# EAGLE design UKHASnet-avr-sensor (EAGLE 6.5.0)
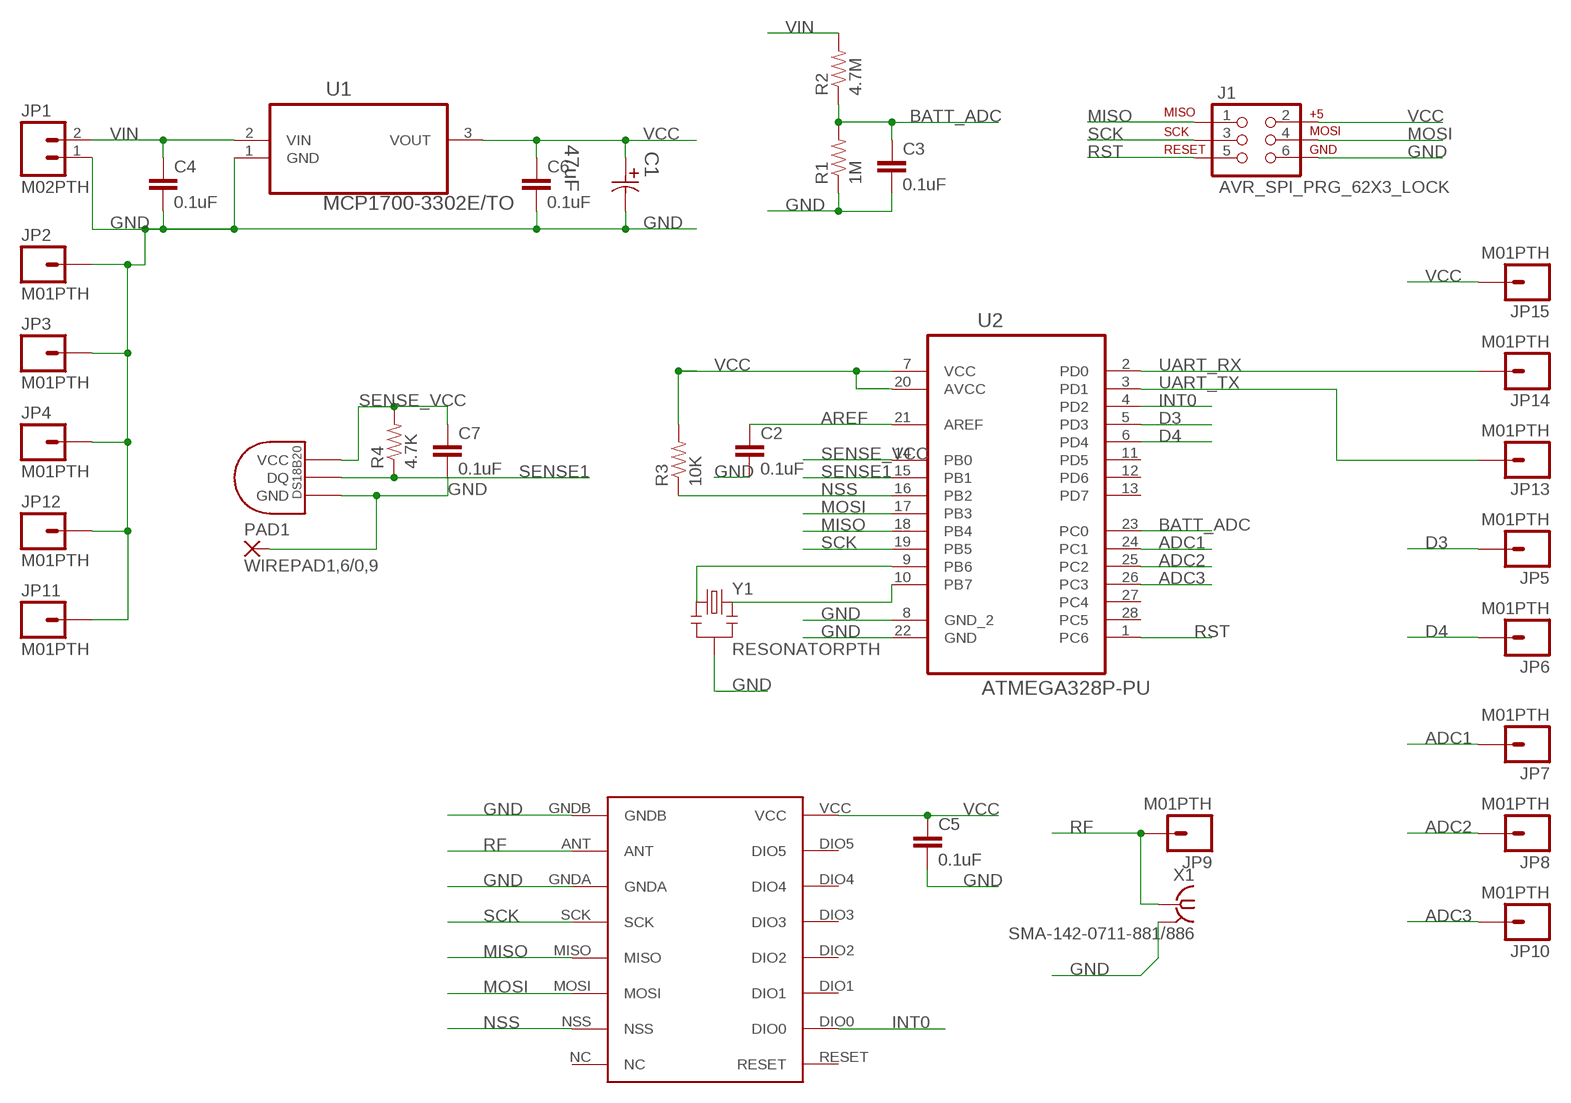
[diagram p0: schematic, sheet 1]

## Parts
C1  47uF  EEUFC1J6R8-P1.5  [CAPPR150-400X1200]
C2  0.1uF  C2.5/2  [C2.5-2]
C3  0.1uF  C2.5/2  [C2.5-2]
C4  0.1uF  C2.5/2  [C2.5-2]
C5  0.1uF  C2.5/2  [C2.5-2]
C6  0.1uF  C2.5/2  [C2.5-2]
C7  0.1uF  C2.5/2  [C2.5-2]
J1  AVR_SPI_PRG_62X3_LOCK  [2X3_LOCK]
JP1  M02PTH  [1X02]
JP2  M01PTH  [1X01]
JP3  M01PTH  [1X01]
JP4  M01PTH  [1X01]
JP5  M01PTH  [1X01]
JP6  M01PTH  [1X01]
JP7  M01PTH  [1X01]
JP8  M01PTH  [1X01]
JP9  M01PTH  [1X01]
JP10  M01PTH  [1X01]
JP11  M01PTH  [1X01]
JP12  M01PTH  [1X01]
JP13  M01PTH  [1X01]
JP14  M01PTH  [1X01]
JP15  M01PTH  [1X01]
PAD1  WIREPAD1,6/0,9  [1,6/0,9]
R1  1M  RESISTORPTH-1/4W  [AXIAL-0.4]
R2  4.7M  RESISTORPTH-1/4W  [AXIAL-0.4]
R3  10K  RESISTORPTH-1/4W  [AXIAL-0.4]
R4  4.7K  RESISTORPTH-1/4W  [AXIAL-0.4]
U1  MCP1700-3302E/TO  [TO127P254X495-3]
U2  ATMEGA328P-PU  [DIP254P762X457-28]
U$1  RFM69HW  [RFM]
U$2  DS1820TO92  [DS1820]
X1  SMA-142-0711-881/886  [J502-ND-142-0711-881/886]
Y1  RESONATORPTH  [RESONATOR-PTH]

## Nets
ADC1: JP7.1 U2.24(PC1)
ADC2: JP8.1 U2.25(PC2)
ADC3: JP10.1 U2.26(PC3)
AREF: C2.1 U2.21(AREF)
BATT_ADC: C3.1 R1.P$2 R2.P$1 U2.23(PC0)
D3: JP5.1 U2.5(PD3)
D4: JP6.1 U2.6(PD4)
GND: C1.2 C2.2 C3.2 C4.2 C5.2 C6.2 C7.2 J1.6 JP1.1 JP2.1 JP3.1 JP4.1 JP11.1 JP12.1 PAD1.1(P) R1.P$1 U1.1(GND) U2.8(GND_2) U2.22(GND) U$1.GNDA U$1.GNDB U$2.GND X1.G@1 X1.G@2 X1.G@3 X1.G@4 Y1.2
INT0: U2.4(PD2) U$1.DIO0
MISO: J1.1 U2.18(PB4) U$1.MISO
MOSI: J1.4 U2.17(PB3) U$1.MOSI
N$10: U2.10(PB7) Y1.3
N$11: U2.9(PB6) Y1.1
NSS: R3.P$1 U2.16(PB2) U$1.NSS
RF [RF]: JP9.1 U$1.ANT X1.1
RST: J1.5 U2.1(PC6)
SCK: J1.3 U2.19(PB5) U$1.SCK
SENSE1: R4.P$1 U2.15(PB1) U$2.DQ
SENSE_VCC: C7.1 R4.P$2 U2.14(PB0) U$2.VDD(VCC)
UART_RX: JP14.1 U2.2(PD0)
UART_TX: JP13.1 U2.3(PD1)
VCC: C1.1 C5.1 C6.1 J1.2 JP15.1 R3.P$2 U1.3(VOUT) U2.7(VCC) U2.20(AVCC) U$1.VCC
VIN: C4.1 JP1.2 R2.P$2 U1.2(VIN)
Unconnected: U2.11(PD5) U2.12(PD6) U2.13(PD7) U2.27(PC4) U2.28(PC5) U$1.DIO1 U$1.DIO2 U$1.DIO3 U$1.DIO4 U$1.DIO5 U$1.NC U$1.RESET

## Library data of the parts
C1 = 1000ufCap:EEU: Aluminum Electrolytic Capacitors; MPN: EEUFC1J6R8; OC_FARNELL: 1848468; OC_NEWARK: 17T5110; RATEDVOLTAGE: 63V; SUPPLIER: PANASONIC; TOLERANCE: ±20 %; VALUE: 6.8UF
C2-C7 = capacitor-wima:C: CAPACITOR naming: grid - package width
J1 = SparkFun-Connectors:AVR_SPI_PRG_6: AVR ISP 6 Pin This is the reduced ISP connector for AVR programming. Common on Arduino. This footprint will take up less PCB space and can be used with a 10-pin to 6-pin adapter such as SKU: BOB-08508
JP1 = SparkFun-Connectors:M02: Standard 2-pin 0.1" header. Use with - straight break away headers ( PRT-00116) - right angle break away headers (PRT-00553) - swiss pins (PRT-00743) - machine pins (PRT-00117) - female headers (PRT-00115) Molex polarized connector foot print use with: PRT-08233 with associated crimp pins and housings. 2.54_SCREWTERM for use with PRT-10571. 3.5mm Screw Terminal footprints for PRT-08084 5mm Screw Terminal footprints for use with PRT-08433
JP2-JP15 = SparkFun-Connectors:M01: Header 1 Standard 1-pin 0.1" header. Use with straight break away headers (SKU : PRT-00116), right angle break away headers (PRT-00553), swiss pins (PRT-00743), machine pins (PRT-00117), and female headers (PRT-00115).
PAD1 = wirepad:WIREPAD: Wire PAD connect wire on PCB
R1-R4 = SparkFun:RESISTOR: Resistor Basic schematic elements and footprints for 0603, 1206, and PTH resistors.
U1 = mcp1700:MCP1700-3302E/TO: IC, Low Quiescent Current LDO,3.3V,TO-92; MPN: MCP1700-3302E/TO; OC_FARNELL: 1296588; OC_NEWARK: 88H9804; PACKAGE: TO-92; SUPPLIER: Microchip
U2 = atmega328-dil:ATMEGA328P-PU: 8-bit Microcontroller with In-System Programmable Flash; MPN: ATMEGA328P-PU; OC_FARNELL: 1715487; OC_NEWARK: 15R0268; PACKAGE: PDIP-28; SUPPLIER: Atmel
U$1 = hopeRF2:RFM69HW
U$2 = Ava:DS1820: DS18B20 Programmable Resolution 1-Wire Digital Thermometer Description The DS18B20 digital thermometer provides 9-bit to 12-bit Celsius temperature measurements and has an alarm function with nonvolatile user-programmable upper and lower trigger points. The DS18B20 communicates over a 1-Wire® bus that by definition requires only one data line (and ground) for communication with a central microprocessor. It has an operating temperature range of -55°C to +125°C and is accurate to ±0.5°C over the range of -10°C to +85°C. In addition, the DS18B20 can derive power directly from the data line ("parasite power"), eliminating the need for an external power supply. Each DS18B20 has a unique 64-bit serial code, which allows multiple DS18B20s to function on the same 1-Wire bus. Thus, it is simple to use one microprocessor to control many DS18B20s distributed over a large area. Applications that can benefit from this feature include HVAC environmental controls, temperature monitoring systems inside buildings, equipment, or machinery, and process monitoring and control systems.
X1 = con-coax:SMA-: SMA 50 Ohm End Launch Jack Receptacle - Round Contact Johnson Components Source: www.johnsoncomponents.com .. J502-ND.pdf; MF: JOHNSON COMPONENTS; MPN: 142-0711-881; OC_FARNELL: unknown; OC_NEWARK: 50B4464
Y1 = SparkFun:RESONATOR: Resonator Small SMD resonator. This is the itty bitty 10/20MHz resonators with built in caps. CSTCE10M0G55 and CSTCE20M0V53. Footprint has been reviewed closely but hasn't been tested yet.

## Net classes
1 RF: clearance 0.381 mm

## Board
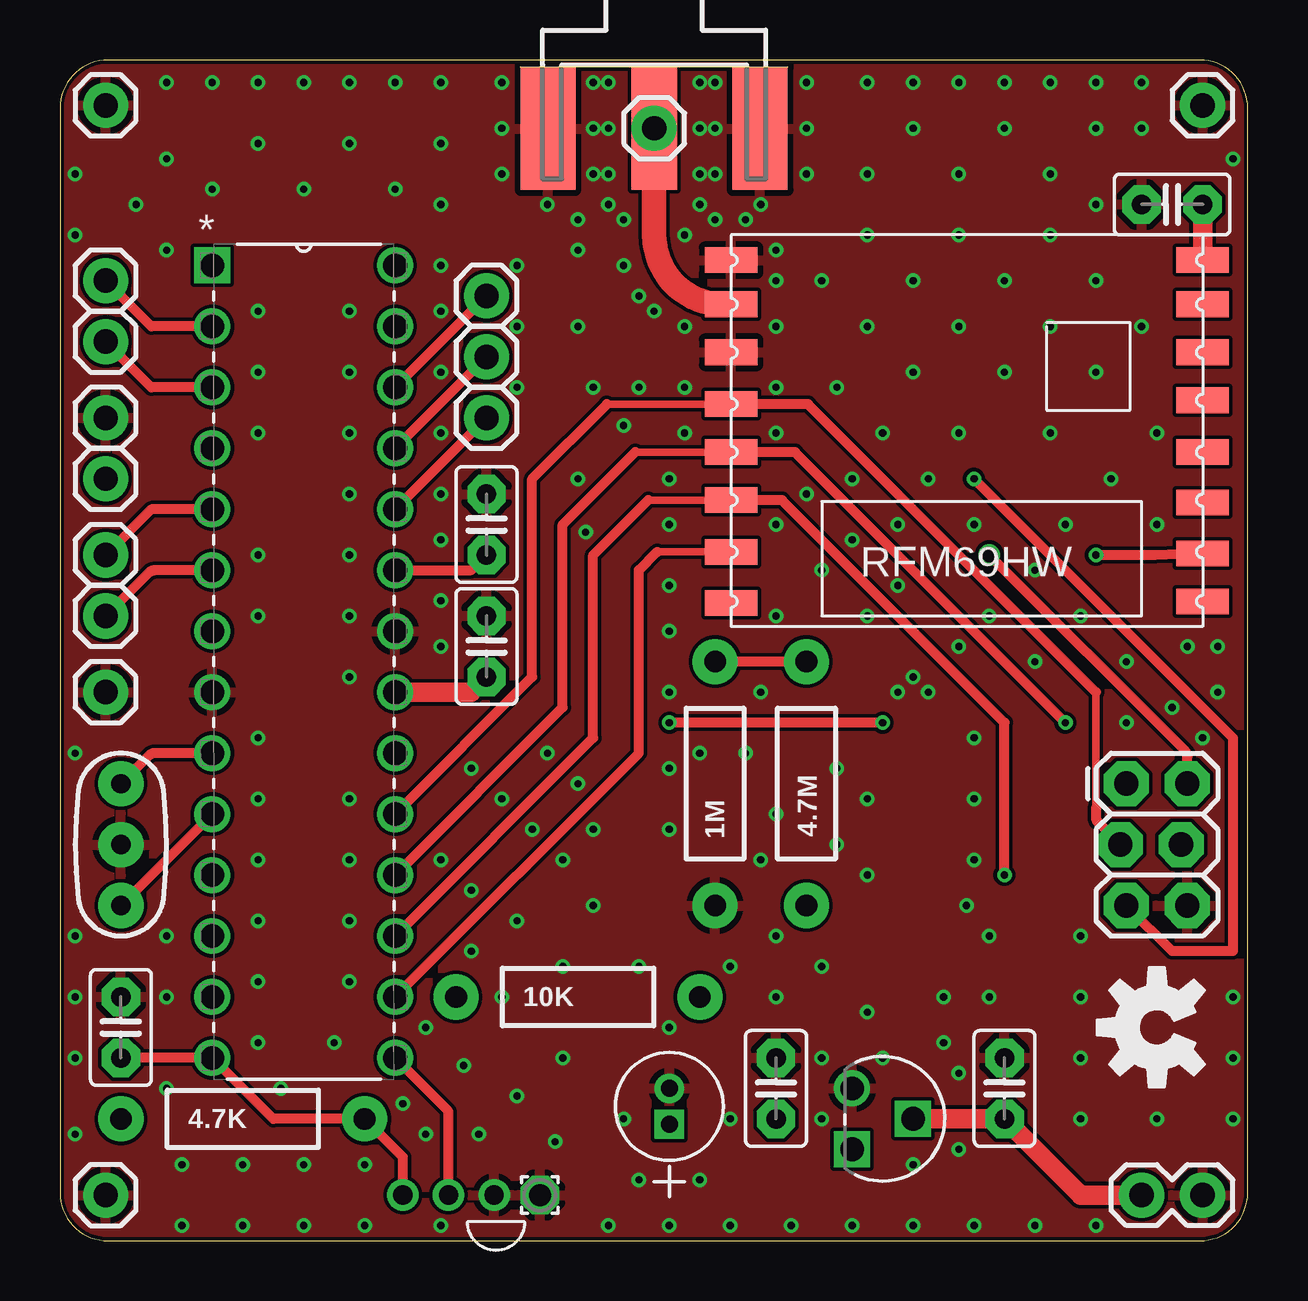
[diagram p1: board, top side]
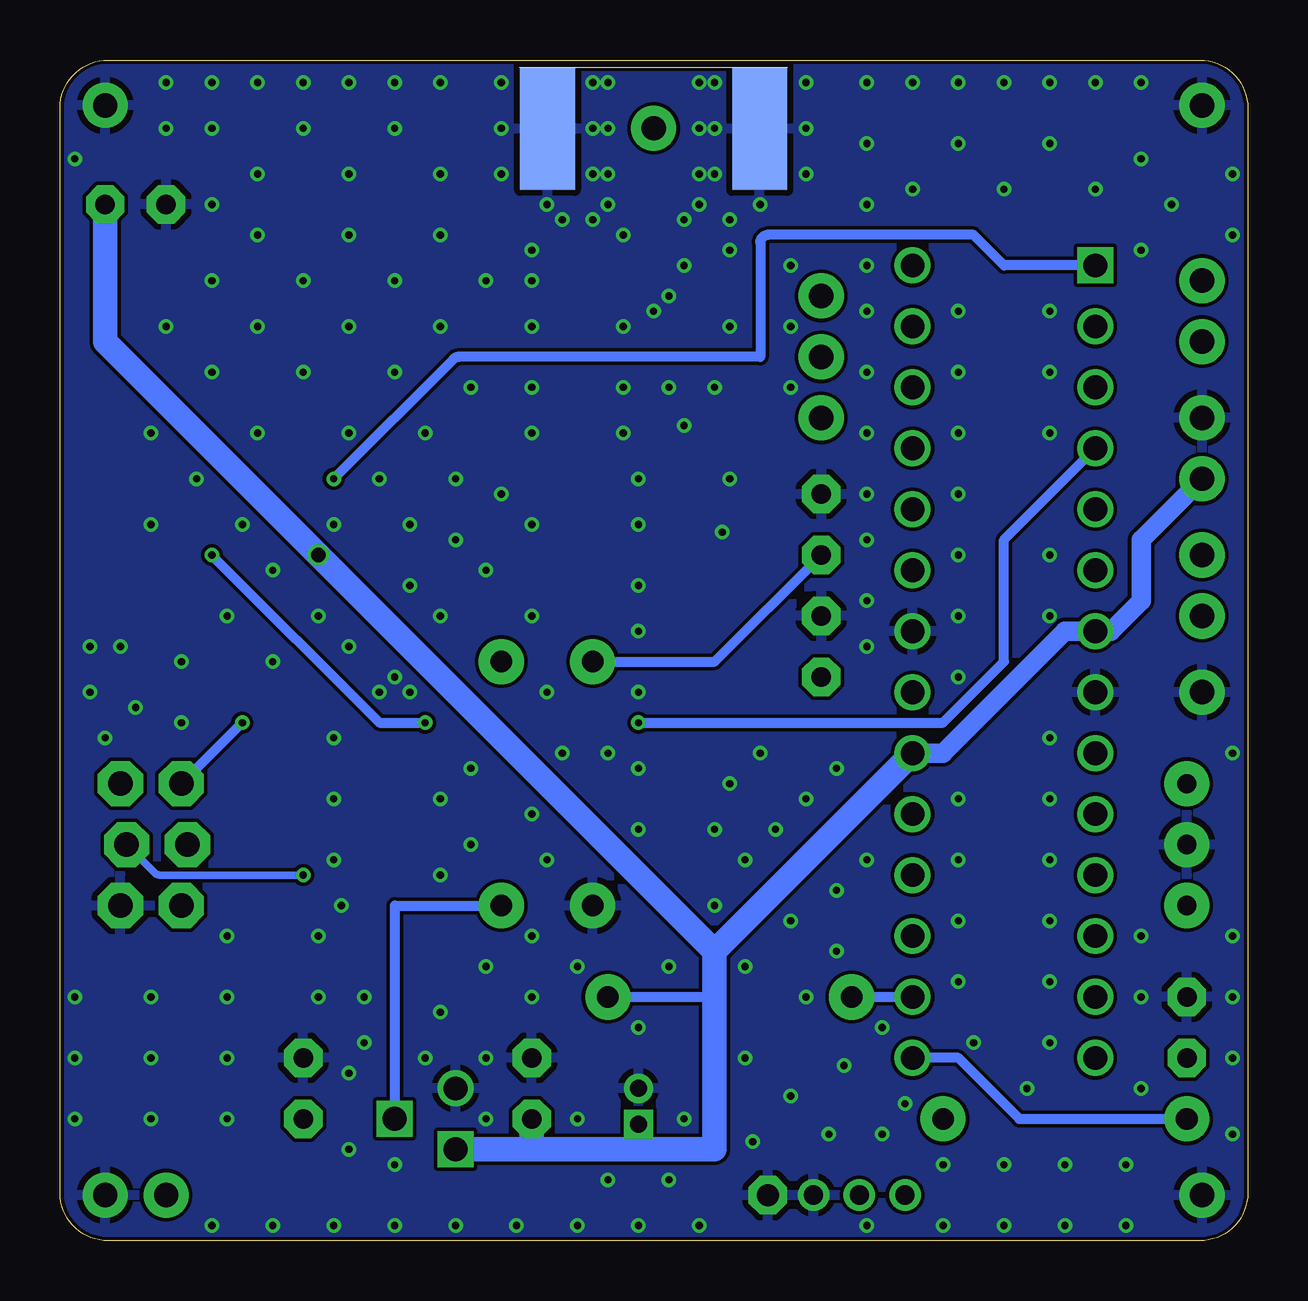
[diagram p2: board, bottom side, seen from below]

Size 49.51 x 49.2 mm. Coordinates in mm from the lower left corner, seen from the top.
Outline: 0,47.2 0,2 arc90 2,0 47.51,0 arc90 49.51,2 49.51,47.2 arc90 47.51,49.2 2,49.2 arc90 0,47.2
Copper layers (1*16): Top 0.035mm / dielectric 1.5mm / Bottom 0.035mm
Design rules "Hackvana": minimum track width 6mil, minimum drill 0.3mm, track to track 6mil, track to pad 6mil, pad to pad 6mil, via to via 6mil, smd to smd 0mil, copper to edge 6mil, drill to drill 6mil, minimum pad ring 10mil, minimum via ring 6mil, stop-mask expansion 2mil, vias tented up to drill 100mil, thermal gap 10mil

### Footprints (pad centres in the part's own frame; a part is rotated, then mirrored left to right if it is on the bottom)
CAPPR150-400X1200 = drill 0.711 square: 1 -1.499,0 | drill 0.711: 2 0,0
C2.5-2 = drill 0.813 pad 1.6 octagon: 1 -1.27,0; 2 1.27,0
2X3_LOCK = drill 1.016 pad 1.88 octagon: 1 0,0; 2 0,2.54; 3 2.54,-0.254; 4 2.54,2.286; 5 5.08,0; 6 5.08,2.54
1X02 = drill 1.016 pad 1.88: 1 0,0; 2 2.54,0
1X01 = drill 1.016 pad 1.88: 1 0,0
1,6/0,9 = drill 0.914 pad 1.6 octagon: 1 0,0
AXIAL-0.4 = drill 0.9 pad 1.88: P$1 -5.08,0; P$2 5.08,0
TO127P254X495-3 = drill 0.991: 1 -2.54,-2.54 | drill 0.991 square: 2 -1.27,0; 3 0,-2.54
DIP254P762X457-28 = drill 0.991 square: 1 -7.62,33.02 | drill 0.991: 2 -7.62,30.48; 3 -7.62,27.94; 4 -7.62,25.4; 5 -7.62,22.86; 6 -7.62,20.32; 7 -7.62,17.78; 8 -7.62,15.24; 9 -7.62,12.7; 10 -7.62,10.16; 11 -7.62,7.62; 12 -7.62,5.08; 13 -7.62,2.54; 14 -7.62,0; 15 0,0; 16 0,2.54; 17 0,5.08; 18 0,7.62; 19 0,10.16; 20 0,12.7; 21 0,15.24; 22 0,17.78; 23 0,20.32; 24 0,22.86; 25 0,25.4; 26 0,27.94; 27 0,30.48; 28 0,33.02
RFM = smd 2.184 x 1.067: ANT 19.651,2.889; DIO0 0,13.27; DIO1 0,11.143; DIO2 0,9.047; DIO3 0,6.889; DIO4 0,4.889; DIO5 0,2.889; GNDA 19.651,4.889; GNDB 19.651,1.048; MISO 19.651,9.047; MOSI 19.651,11.047; NC 19.651,15.334; NSS 19.651,13.206; RESET 0,15.27; SCK 19.651,7.048; VCC 0,1.048
DS1820 = drill 0.8: DQ 2.54,-1.27; GND 0.635,-1.27; VDD 4.445,-1.27
J502-ND-142-0711-881/886 = smd 5.08 x 1.905: 1 2.565,0 | smd 5.08 x 2.286: G@1 2.565,4.42; G@2 2.565,-4.42 | smd 5.08 x 2.286 bottom: G@3 2.565,4.42; G@4 2.565,-4.42
RESONATOR-PTH = drill 0.8 pad 1.88: 1 -2.54,0; 2 0,0; 3 2.54,0

### Placement (x,y rotation side)
C1  25.4,6.35 90 top
C2  17.78,24.77 90 top
C3  17.78,29.84 90 top
C4  39.37,6.35 90 top
C5  46.35,43.18 180 top
C6  29.84,6.35 90 top
C7  2.54,8.89 90 top
J1  44.45,19.05 270 top
JP1  47.62,1.91 180 top
JP2  1.91,1.91 0 top
JP3  47.62,47.31 0 top
JP4  1.91,47.31 0 top
JP5  1.91,28.57 0 top
JP6  1.91,26.04 0 top
JP7  17.78,34.29 0 top
JP8  17.78,36.83 0 top
JP9  24.77,46.35 0 top
JP10  17.78,39.37 0 top
JP11  1.91,22.86 0 top
JP12  1.91,34.29 0 top
JP13  1.91,37.47 0 top
JP14  1.91,40.01 0 top
JP15  1.91,31.75 0 top
PAD1  20,1.91 0 top
R1  27.3,19.05 90 top
R2  31.11,19.05 270 top
R3  21.59,10.16 0 top
R4  7.62,5.08 0 top
U1  35.56,3.81 270 top
U2  13.97,7.62 0 top
U$1  47.62,41.91 180 top
U$2  18.73,0.64 180 top
U$3  [OSHW-LOGO-M]  45.72,8.89 90 top
X1  24.77,48.9 270 top
Y1  2.54,16.51 270 top

### Tracks (layer width: path | path; a pad name or v marks a point on that pad's centre or on a via)
ADC1
  Top 0.406: U2.24 JP7.1
ADC2
  Top 0.406: U2.25 JP8.1
ADC3
  Top 0.406: U2.26 JP10.1
AREF
  Top 0.813: U2.21 17.14,22.86 C2.1
BATT_ADC
  Top 0.406: R2.P$1 R1.P$2 | U2.23 17.14,27.94 C3.1
  Bottom 0.406: R1.P$2 22.23,24.13 C3.1
D3
  Top 0.406: U2.5 3.81,30.48 JP5.1
D4
  Top 0.406: U2.6 3.94,27.94 arc45 3.72,27.85 JP6.1
GND  (via drill 0.3)
  other vias: 10.16,43.81 0.64,20.32 0.64,12.7 4.45,12.7 0.64,10.16 4.45,48.26 6.35,48.26 8.26,48.26 10.16,48.26 12.06,48.26 13.97,48.26 15.88,48.26 18.41,48.26 18.41,46.35 18.41,44.45 22.23,48.26 22.23,46.35 22.23,44.45 27.3,48.26 27.3,46.35 27.3,44.45 23.5,42.55 27.3,42.55 28.57,42.55 24.77,38.73 26.04,38.1 29.84,38.1 29.84,40.01 26.04,41.91 24.13,39.37 31.11,44.45 31.11,46.35 31.11,48.26 33.66,48.26 35.56,48.26 37.47,48.26 39.37,48.26 41.27,48.26 43.18,48.26 45.09,48.26 15.88,45.72 12.06,45.72 8.26,45.72 4.45,45.09 13.97,43.81 6.35,43.81 0.64,44.45 0.64,41.91 3.17,43.18 4.45,41.27 8.26,38.73 12.06,38.73 8.26,36.2 12.06,36.2 8.26,33.66 12.06,33.66 12.06,31.11 8.26,28.57 12.06,28.57 12.06,26.04 8.26,20.95 8.26,18.41 12.06,18.41 8.26,15.88 12.06,15.88 12.06,23.5 8.26,26.04 8.26,13.34 12.06,13.34 8.26,10.79 12.06,10.79 11.43,8.26 8.26,8.26 0.64,7.62 0.64,4.45 5.08,0.64 7.62,0.64 10.16,0.64 12.7,0.64 15.88,0.64 4.45,6.35 9.21,6.35 22.86,0.64 25.4,0.64 27.94,0.64 30.48,0.64 33.02,0.64 35.56,0.64 38.1,0.64 40.64,0.64 43.18,0.64 48.9,5.08 48.9,7.62 48.9,10.16 37.47,3.81 35.56,3.17 37.47,6.99 37.78,13.97 45.72,10.16 45.72,7.62 35.56,46.35 39.37,46.35 43.18,46.35 41.27,44.45 37.47,44.45 33.66,44.45 33.66,41.91 37.47,41.91 41.27,41.91 29.21,43.18 31.75,40.01 35.56,40.01 39.37,40.01 43.18,40.01 33.66,38.1 37.47,38.1 41.27,38.1 43.18,36.2 39.37,36.2 35.56,36.2 37.47,33.66 41.27,33.66 43.81,31.75 45.72,33.66 41.91,29.84 45.72,29.84 32.38,35.56 34.29,33.66 38.1,29.84 36.2,31.75 48.26,24.77 48.26,22.86 29.84,35.56 26.04,35.56 24.13,35.56 22.23,35.56 45.09,38.1 4.45,10.16 21.59,42.55 7.62,3.17 12.7,3.17 16.83,7.3 19.05,6.03 20.95,7.62 18.41,10.16 17.14,14.61 15.88,15.88 18.41,18.41 19.68,17.14 17.14,19.68 20.95,11.43 19.05,13.34 17.14,12.06 21.59,19.05 20.32,20.32 21.59,31.75 21.91,29.53 15.88,26.67 15.88,29.21 15.88,24.77 25.4,29.84 25.4,31.75 31.11,31.11 34.92,27.3 33.02,29.21 33.66,26.04 31.75,27.94 29.84,29.84 29.84,26.04 25.4,27.3 37.47,24.77 35.56,23.5 25.4,19.68 29.84,12.7 22.23,17.14 20.95,15.88 22.23,13.97 33.66,9.53 25.4,17.14 26.67,20.32 28.57,20.32 29.21,22.86 29.21,15.88 29.84,17.78 32.38,19.68 34.92,22.86 33.66,18.41 32.38,16.51 38.1,20.95 42.55,10.16 42.55,7.62 45.72,5.08 42.55,5.08 38.73,10.16 38.73,12.7 42.55,12.7 36.83,10.16 38.1,15.88 38.1,18.41 33.66,15.24 36.2,22.86 47.62,20.95 29.84,10.16 46.99,24.77 40.64,27.94 42.55,26.04 44.45,24.13 46.35,22.23 29.84,33.66 26.04,33.66 23.5,33.97 33.02,31.75 34.92,29.84 38.73,26.04 40.64,24.13 44.45,21.59 27.94,5.08 24.13,11.43 23.5,5.08 25.4,8.89 27.94,11.43 31.75,11.43 31.75,7.62 31.75,5.08 21.59,38.1 21.59,41.27 20.32,43.18 19.05,40.64 15.88,40.64 19.05,38.1 19.05,35.56 15.88,33.66 15.88,36.2 15.88,38.73 15.88,31.11 25.4,22.86 15.88,43.18 25.4,25.4 45.09,46.35 48.9,45.09 43.18,43.18 29.84,41.27 22.86,48.26 22.86,46.35 22.86,44.45 26.67,48.26 26.67,46.35 26.67,44.45 26.67,43.18 22.86,43.18 23.5,40.64 20.64,4.13 15.24,8.89 15.24,4.45 14.29,5.71 17.46,4.45 24.13,2.54 26.67,2.54 34.29,7.62 36.83,8.26 10.16,3.17 5.08,3.17
  pour Bottom: -1.27,50.8 52.07,50.8 52.07,-2.54 -1.27,-2.54
  pour Top: -1.27,50.8 52.07,50.8 52.07,-2.54 -1.27,-2.54
INT0  (via drill 0.3)
  Top 0.406: U$1.DIO0 45.66,28.57 v43.18,28.57 | v34.29,21.59 v25.4,21.59
  Bottom 0.406: v43.18,28.57 36.2,21.59 v34.29,21.59 | v25.4,21.59 12.7,21.59 10.16,24.13 10.16,29.21 U2.4
MISO  (via drill 0.3)
  Top 0.305: U$1.MISO 23.97,32.86
  Top 0.406: U2.18 20.95,22.23 20.95,29.84 23.97,32.86 | v41.91,21.59 30.64,32.86 U$1.MISO
  Bottom 0.406: v41.91,21.59 J1.1
MOSI  (via drill 0.3)
  Top 0.305: U$1.MOSI 24.51,30.86
  Top 0.406: U2.17 22.23,20.95 22.23,28.57 24.51,30.86 | v39.37,15.24 39.37,21.59 30.1,30.86 U$1.MOSI
  Bottom 0.305: v39.37,15.24 45.33,15.24 arc45 45.56,15.33 J1.4
N$10
  Top 0.406: U2.10 Y1.3
N$11
  Top 0.406: U2.9 3.94,20.32 arc45 3.72,20.23 Y1.1
NSS
  Top 0.305: U$1.NSS 24.89,28.7
  Top 0.406: U2.16 24.13,20.32 24.13,27.94 24.89,28.7
  Bottom 0.406: R3.P$1 U2.16
RF
  Top 1.016: U$1.ANT 27.65,39.02 arc-90 24.77,41.91 JP9.1 X1.1
RST  (via drill 0.3)
  Top 0.406: v38.1,31.75 48.9,20.95 48.9,12.06 46.35,12.06 J1.5
  Bottom 0.406: U2.1 10.16,40.64 11.43,41.91 20,41.91 arc-90 20.32,41.59 20.32,36.83 32.89,36.83 arc-45 33.11,36.74 v38.1,31.75
SCK
  Top 0.305: 43.18,22.86 43.18,18.03 | U$1.SCK 22.8,34.86
  Top 0.406: U2.19 19.68,23.5 19.68,31.75 22.8,34.86 | U$1.SCK 31.18,34.86 43.18,22.86 | 43.18,18.03 43.18,17.66 arc45 43.27,17.43 J1.3
SENSE1
  Top 0.406: U$2.DQ 16.19,5.4 U2.15
  Bottom 0.406: U2.15 12.06,7.62 9.53,5.08 R4.P$1
SENSE_VCC
  Top 0.406: C7.1 U2.14 8.89,5.08 R4.P$2 14.29,3.49 U$2.VDD
UART_RX
  Top 0.406: U2.2 3.81,38.1 JP14.1
UART_TX
  Top 0.406: U2.3 3.81,35.56 JP13.1
VCC  (via drill 0.6)
  Top 0.406: J1.2 46.99,20.19 arc45 46.9,20.41 v38.73,28.57
  Top 0.813: U$1.VCC C5.1
  Bottom 0.406: R3.P$2 22.23,10.16
  Bottom 0.813: U2.20 12.7,20.32 7.62,25.4 U2.7 5.71,25.4 4.45,26.67 4.45,29.21 JP15.1
  Bottom 1.016: C5.1 47.62,37.47 v38.73,28.57 22.23,12.06 | U1.3 29.84,3.81 | 29.84,3.81 25.4,3.81 | 25.4,3.81 22.23,3.81 22.23,10.16 22.23,12.06 | C1.1 25.4,3.81 | U2.20 22.23,12.06 | C6.1 29.84,3.81
VIN
  Top 0.813: JP1.2 42.55,1.91 C4.1 U1.2
  Bottom 0.406: U1.2 35.56,13.97 R2.P$2

### Text on the board
tDocu: RX | A3 | TX | A2 | G | A1 | + | D3 | D4 | G | https://ukhas.net/ | Sensor V2 | Phil M0DNY | max 6V | +